# Altium schematic sheet LV_breakout_main.SchDoc
size 381 x 241 mm; SheetNumber: 1; SheetTotal: 5
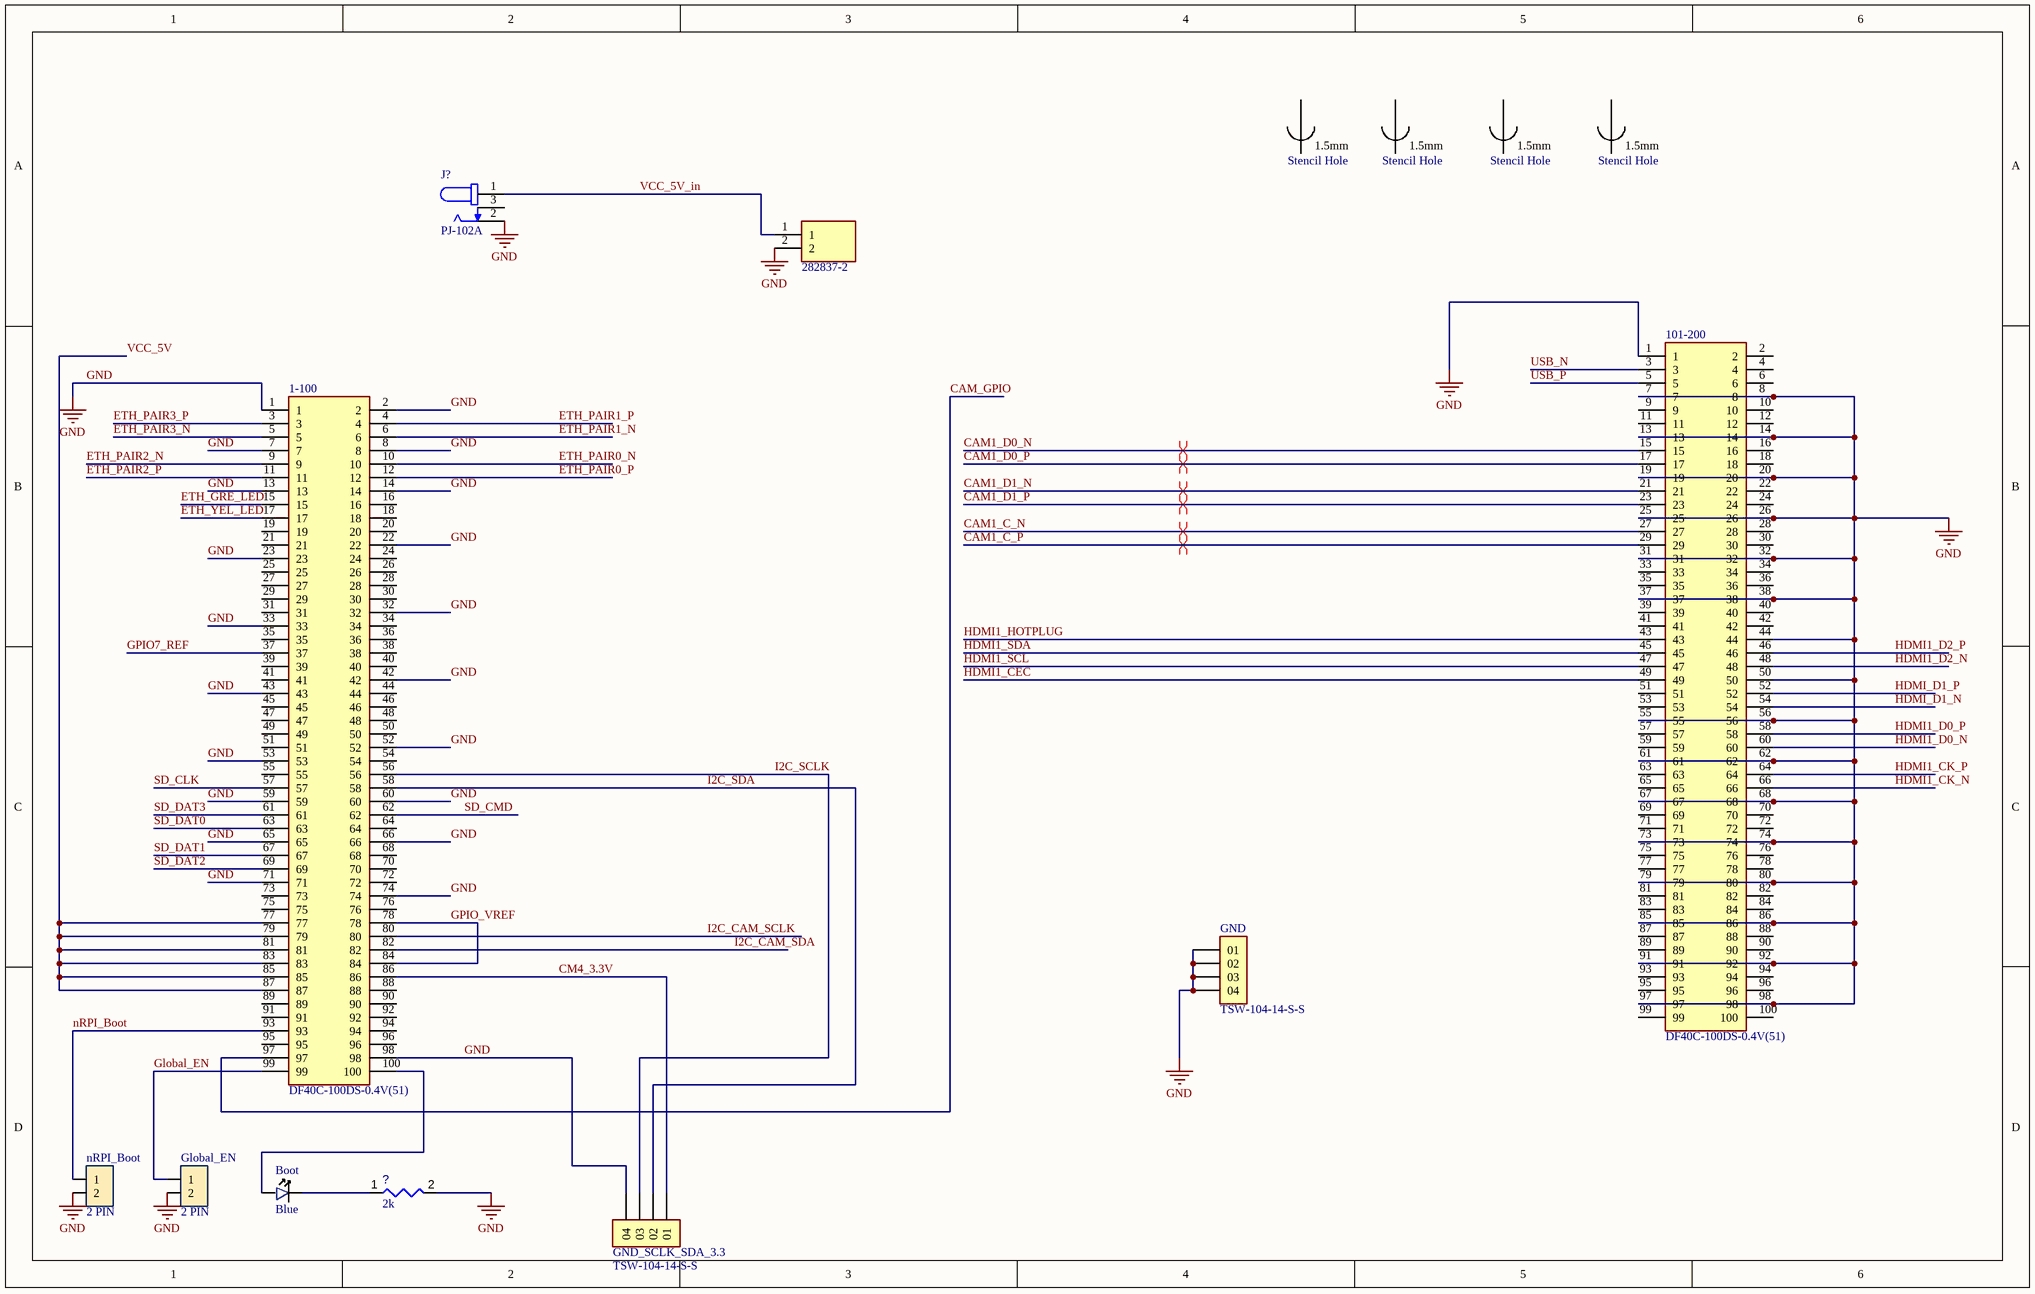
[diagram p0: LV_breakout_main.SchDoc]

## Parts
(Parts that share a designator on the sheet are numbered #1, #2 ... from top to bottom, then left to right.)
1-100  DF40C-100DS-0.4V(51)  [HRS_DF40C-100DS-0.4V(51)]
101-200  DF40C-100DS-0.4V(51)  [HRS_DF40C-100DS-0.4V(51)]
?#1  Stencil Hole  [AlignmentHole_1.5mm]
?#2  Stencil Hole  [AlignmentHole_1.5mm]
?#3  Stencil Hole  [AlignmentHole_1.5mm]
?#4  Stencil Hole  [AlignmentHole_1.5mm]
?#5  282837-2  [2828372]
?#6  value 2k  [RESC2013X50X35ML15T15]  (hidden comment: Resistor 10k +/-1% 0805 125 mW)
Boot  value Blue  [LED_0603]  (hidden comment: 0603Bl)
Global_EN  2 PIN  [2_PIN_100MIL]
GND  TSW-104-14-S-S  [JM-4_TSW-104-14-S-S]
GND_SCLK_SDA_3.3  TSW-104-14-S-S  [JM-4_TSW-104-14-S-S]
J?  PJ-102A  [CUI_PJ-102A]
nRPI_Boot  2 PIN  [2_PIN_100MIL]

## Nets
GND: 1-100.1 1-100.2 1-100.7 1-100.8 1-100.13 1-100.14 1-100.22 1-100.23 1-100.32 1-100.33 1-100.42 1-100.43 1-100.52 1-100.53 1-100.59 1-100.60 1-100.65 1-100.66 1-100.71 1-100.74 1-100.98 101-200.1 101-200.7 101-200.8 101-200.13 101-200.14 101-200.19 101-200.20 101-200.25 101-200.26 101-200.31 101-200.32 101-200.37 101-200.38 101-200.44 101-200.50 101-200.55 101-200.56 101-200.61 101-200.62 101-200.67 101-200.68 101-200.73 101-200.74 101-200.79 101-200.80 101-200.85 101-200.86 101-200.91 101-200.92 101-200.97 101-200.98 ?#5.2 ?#6.2 Global_EN.2 GND.01 GND.02 GND.03 GND.04 GND_SCLK_SDA_3.3.04 J?.2 nRPI_Boot.2
CAM1_C_N: 101-200.27
CAM1_C_P: 101-200.29
CAM1_D0_N: 101-200.15
CAM1_D0_P: 101-200.17
CAM1_D1_N: 101-200.21
CAM1_D1_P: 101-200.23
CAM_GPIO: 1-100.97
CM4_3.3V: 1-100.86 GND_SCLK_SDA_3.3.01
ETH_GRE_LED: 1-100.15
ETH_PAIR0_N: 1-100.10
ETH_PAIR0_P: 1-100.12
ETH_PAIR1_N: 1-100.6
ETH_PAIR1_P: 1-100.4
ETH_PAIR2_N: 1-100.9
ETH_PAIR2_P: 1-100.11
ETH_PAIR3_N: 1-100.5
ETH_PAIR3_P: 1-100.3
ETH_YEL_LED: 1-100.17
Global_EN: 1-100.99 Global_EN.1
GPIO7_REF: 1-100.37
GPIO_VREF: 1-100.78 1-100.84
HDMI1_CEC: 101-200.49
HDMI1_CK_N: 101-200.66
HDMI1_CK_P: 101-200.64
HDMI1_D0_N: 101-200.60
HDMI1_D0_P: 101-200.58
HDMI1_D2_N: 101-200.48
HDMI1_D2_P: 101-200.46
HDMI1_HOTPLUG: 101-200.43
HDMI1_SCL: 101-200.47
HDMI1_SDA: 101-200.45
HDMI_D1_N: 101-200.54
HDMI_D1_P: 101-200.52
I2C_CAM_SCLK: 1-100.80
I2C_CAM_SDA: 1-100.82
I2C_SCLK: 1-100.56 GND_SCLK_SDA_3.3.03
I2C_SDA: 1-100.58 GND_SCLK_SDA_3.3.02
nRPI_Boot: 1-100.93 nRPI_Boot.1
SD_CLK: 1-100.57
SD_CMD: 1-100.62
SD_DAT0: 1-100.63
SD_DAT1: 1-100.67
SD_DAT2: 1-100.69
SD_DAT3: 1-100.61
USB_N: 101-200.3
USB_P: 101-200.5
VCC_5V: 1-100.77 1-100.79 1-100.81 1-100.83 1-100.85 1-100.87
VCC_5V_in: ?#5.1 J?.1
Net1-100_100: 1-100.100 Boot.1
Net?#6_1: ?#6.1 Boot.2

Not connected (* = marked no-connect by the designer): 1-100 16 18 19 20 21 24 25 26 27 28 29 30 31 34 35 36 38 39 40 41 44 45 46 47 48 49 50 51 54 55 64 68 70 72 73 75 76 88 89 90 91 92 94 95 96; 101-200 2 4 6 9 10 11 12 16 18 22 24 28 30 33 34 35 36 39 40 41 42 51 53 57 59 63 65 69 70 71 72 75 76 77 78 81 82 83 84 87 88 89 90 93 94 95 96 99 100; J? 3

## Layout directives
differential pair: CAM1_C_N, CAM1_C_P, CAM1_D0_N, CAM1_D0_P, CAM1_D1_N, CAM1_D1_P

## Notes on the sheet
- (in symbol H_StencilAllignment_1.5mm) 1.5mm

## Library data of the parts
1-100 101-200 = CMP-005-000000-1: DF40 Series 100 Position Dual Row 0.4 mm Pitch Surface Mount Vertical Receptacle; Price: None; Component Type: Standard; Design Item ID: DF40C-100DS-0.4V(51); Package: None; Source: DF40C-100DS-0.4V(51).SchLib; Availability: Unavailable; MP: DF40C-100DS-0.4V(51); Pin Count: 100; Value: *
?#1-?#4 = H_StencilAllignment_1.5mm: Stencil Allignment hole for use with 1.5mm pin
?#5 = 282837-2: Fixed Terminal Blocks 5.08MM PCB MOUNT 2P; Manufacturer_Name: TE Connectivity; Geometry.Height: 10.3mm; Manufacturer_Part_Number: 282837-2; Mouser Part Number: 571-2828372; Mouser Price/Stock: https://www.mouser.co.uk/ProductDetail/TE-Connectivity/282837-2?qs=A%252Bip%252BNCYi6O2H0NGWOeAxg%3D%3D; Arrow Part Number: 282837-2; Arrow Price/Stock: https://www.arrow.com/en/products/282837-2/te-connectivity?region=europe; Datasheet Link: https://www.te.com/commerce/DocumentDelivery/DDEController?Action=srchrtrv&DocNm=282837&DocType=Customer+Drawing&DocLang=English&DocFormat=pdf&PartCntxt=282837-2
?#6 = CMP-009-00018-5: Chip Resistor, 10 KOhm, +/- 1%, 125 mW, -55 to 155 degC, 0805 (2012 Metric); Power: 125mW; Voltage Rating: 150V; Tolerance: 1%; Pins: 2; Min Operating Temperature: -55°C; Case/Package: 0805; Max Operating Temperature: 155°C; RoHS Compliant: True; Mounting Technology: SM
Boot = LED_BLUE_0603: LIGHT EMITTING DIODES (LED) BLUE 465~475NM 11.5~28.5MCD@5MA TOP VIEW 0603 ROHS; MFR Part #: 19-217/BHC-ZL1M2RY/3T; LCSC Part#: C72041; Type: Basic
Global_EN nRPI_Boot = JM_2_PIN_MALE: 2.54mm Straight 2 1 Header，Breakaway Through Hole,P=2.54mm Pin Header & Female Header ROHS; MFR Part #: B-2100S02P-A110; Type: Extended; Datasheet: https://datasheet.lcsc.com/lcsc/1811151421_Ckmtw-Shenzhen-Cankemeng-B-2100S02P-A110_C124375.pdf; LCSC Part#: C124375; Value: 2 PIN
GND GND_SCLK_SDA_3.3 = JM_4_PIN_MALE: Square Pins 2.5mm 6mm -40℃~+105℃ 1 4 3mm 2.54mm Black 1x4P Straight,P=2.54mm  Pin Headers ROHS; MFR PART #: PZ254V-11-04P; MP: TSW-104-14-S-S; LCSC PART#: C2691448
J? = PJ-102A: 2.0 x 6.5 mm, 2.5 A, Horizontal, Through Hole, Tapered Pins, Dc Power Jack Connector; MF: CUI Devices; Price: None; Availability: In Stock; Package: None; MP: PJ-102A; CUI_purchase_URL: https://www.cuidevices.com/product/interconnect/connectors/dc-power-connectors/jacks/pj-102a?utm_source=snapeda.com&utm_medium=referral&utm_campaign=snapedaBOM; Value: *; SnapEDA_Link: https://www.snapeda.com/parts/PJ-102A/CUI+Devices/view-part/?ref=snap; Purchase-URL: https://pricing.snapeda.com/search/part/PJ-102A/?ref=eda; Check_prices: https://www.snapeda.com/parts/PJ-102A/CUI+Devices/view-part/?ref=eda